# EAGLE design MacroKeypad-Button (EAGLE 9.2.2)
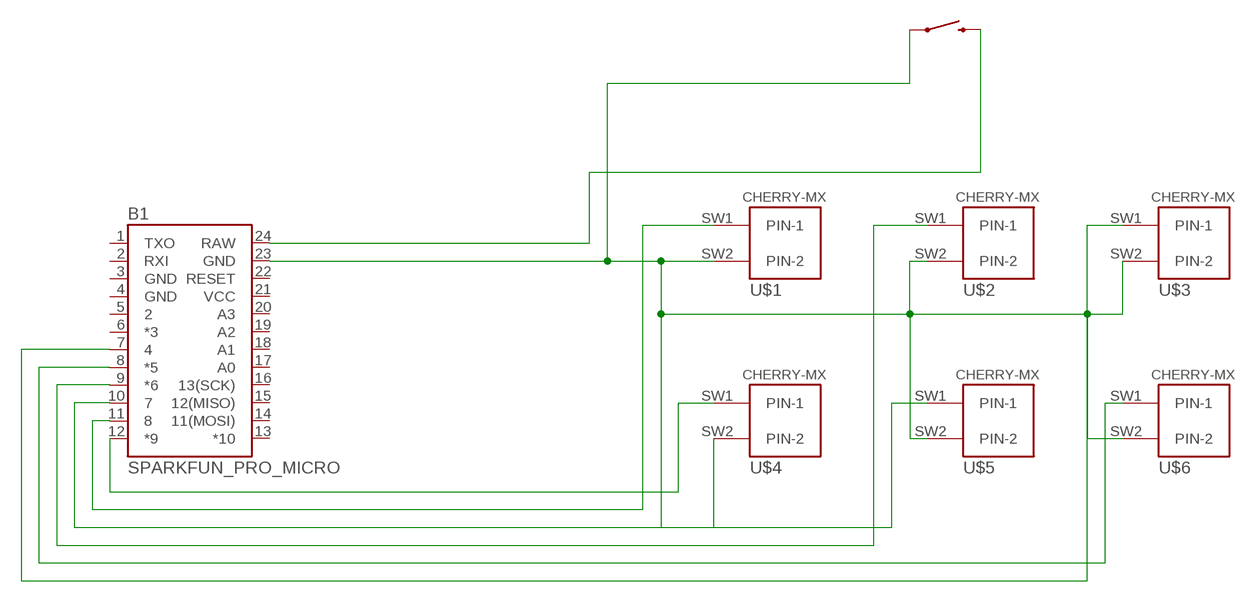
[diagram p0: schematic, sheet 1]

## Parts
B1  SPARKFUN_PRO_MICRO  [SPARKFUN_PRO_MICRO]
S1  MOMENTARY-SWITCH-SPST-PTH-6.0MM  [TACTILE_SWITCH_PTH_6.0MM]
U$1  CHERRY-MX  [CHERRY-MX]
U$2  CHERRY-MX  [CHERRY-MX]
U$3  CHERRY-MX  [CHERRY-MX]
U$4  CHERRY-MX  [CHERRY-MX]
U$5  CHERRY-MX  [CHERRY-MX]
U$6  CHERRY-MX  [CHERRY-MX]

## Nets
GND: B1.23(GND) S1.1 U$1.SW2(PIN-2) U$2.SW2(PIN-2) U$3.SW2(PIN-2) U$4.SW2(PIN-2) U$5.SW2(PIN-2) U$6.SW2(PIN-2)
RESET: B1.24(RAW) S1.3
SW1: B1.11 U$1.SW1(PIN-1)
SW2: B1.9(*6) U$2.SW1(PIN-1)
SW3: B1.7 U$3.SW1(PIN-1)
SW4: B1.12(*9) U$4.SW1(PIN-1)
SW5: B1.10 U$5.SW1(PIN-1)
SW6: B1.8(*5) U$6.SW1(PIN-1)
Unconnected: B1.1(TXO) B1.2(RXI) B1.5 B1.6(*3) B1.13(*10) B1.14(11(MOSI)) B1.15(12(MISO)) B1.16(13(SCK)) B1.17(A0) B1.18(A1) B1.19(A2) B1.20(A3) B1.22(RESET)

## Power pins joined to a net without a drawn wire
GND: B1.3(GND) B1.4(GND)
VCC: B1.21(VCC)

## Library data of the parts
B1 = SparkFun-Boards:SPARKFUN_PRO_MICRO: SparkFun Pro Micro Atmega32U4 compatible footprint. SparkFun Products: 3.3V/8MHz <https://www.sparkfun.com/products/12587> 5V/16MHz <https://www.sparkfun.com/products/12640>
S1 = SparkFun-Switches:MOMENTARY-SWITCH-SPST: Momentary Switch (Pushbutton) - SPST Normally-open (NO) SPST momentary switches (buttons, pushbuttons). Variants PTH-12MM - 12mm square, through-hole Momentary Pushbutton Switch - 12mm Square <https://www.sparkfun.com/products/9190> (COM-09190) PTH-6.0MM, PTH-6.0MM-KIT - 6.0mm square, through-hole Mini Pushbutton Switch <https://www.sparkfun.com/products/97> (COM-00097) KIT package intended for soldering kit's - only one side of pads' copper is exposed. PTH-RIGHT-ANGLE-KIT - Right-angle, through-hole Right Angle Tactile Button <https://www.sparkfun.com/products/10791> - Used on SparkFun BigTime Watch Kit <https://www.sparkfun.com/products/11734> SMD-12MM - 12mm square, surface-mount Tactile Button - SMD (12mm) <https://www.sparkfun.com/products/12993> (COM-12993) Used on SparkFun PicoBoard <https://www.sparkfun.com/products/11888> SMD-4.5MM - 4.5mm Square Trackball Switch Used on SparkFun Blackberry Trackballer Breakout <https://www.sparkfun.com/products/13169> SMD-4.6MMX2.8MM - 4.60mm x 2.80mm, surface mount Used on SparkFun SAMD21 Mini Breakout <https://www.sparkfun.com/products/13664> SMD-5.2MM, SMD-5.2-REDUNDANT - 5.2mm square, surface-mount Mini Pushbutton Switch - SMD <https://www.sparkfun.com/products/8720> (COM-08720) Used on Arduino Pro Mini <https://www.sparkfun.com/products/11114> REDUNDANT package connects both switch circuits together SMD-6.0X3.5MM - 6.0 x 3.5mm, surface mount Momentary Reset Switch SMD <https://www.sparkfun.com/products/8229> (COM-08229) SMD-6.2MM-TALL - 6.2mm square, surface mount Tactile Button - SMD (6mm) <https://www.sparkfun.com/products/12992> Used on SparkFun Digital Sandbox <https://www.sparkfun.com/products/12651> SMD-RIGHT-ANGLE - Right-angle, surface mount Used on SparkFun Block for Intel® Edison - Arduino <https://www.sparkfun.com/products/13036>; PROD_ID: SWCH-08441; SF_SKU: COM-00097
U$1-U$6 = cherrymx:CHERRY-MX: Cherry MX series keyswitch

## Board
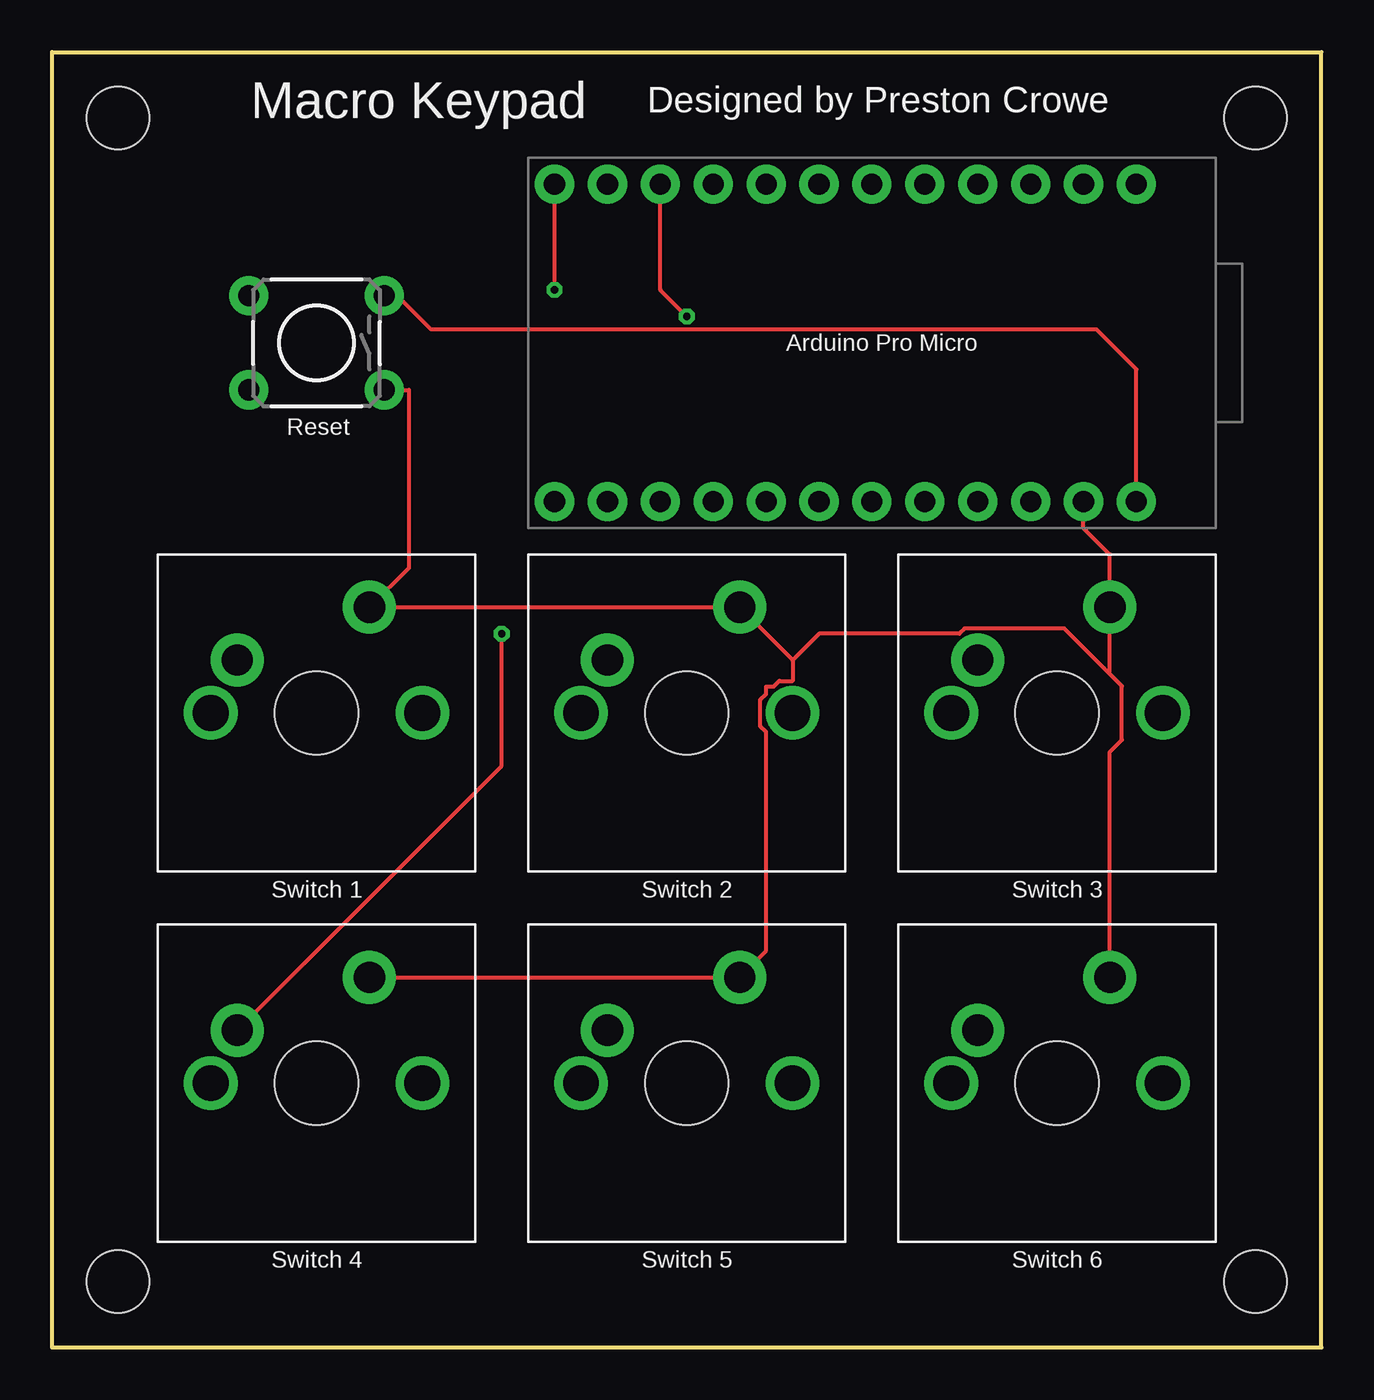
[diagram p1: board, top side]
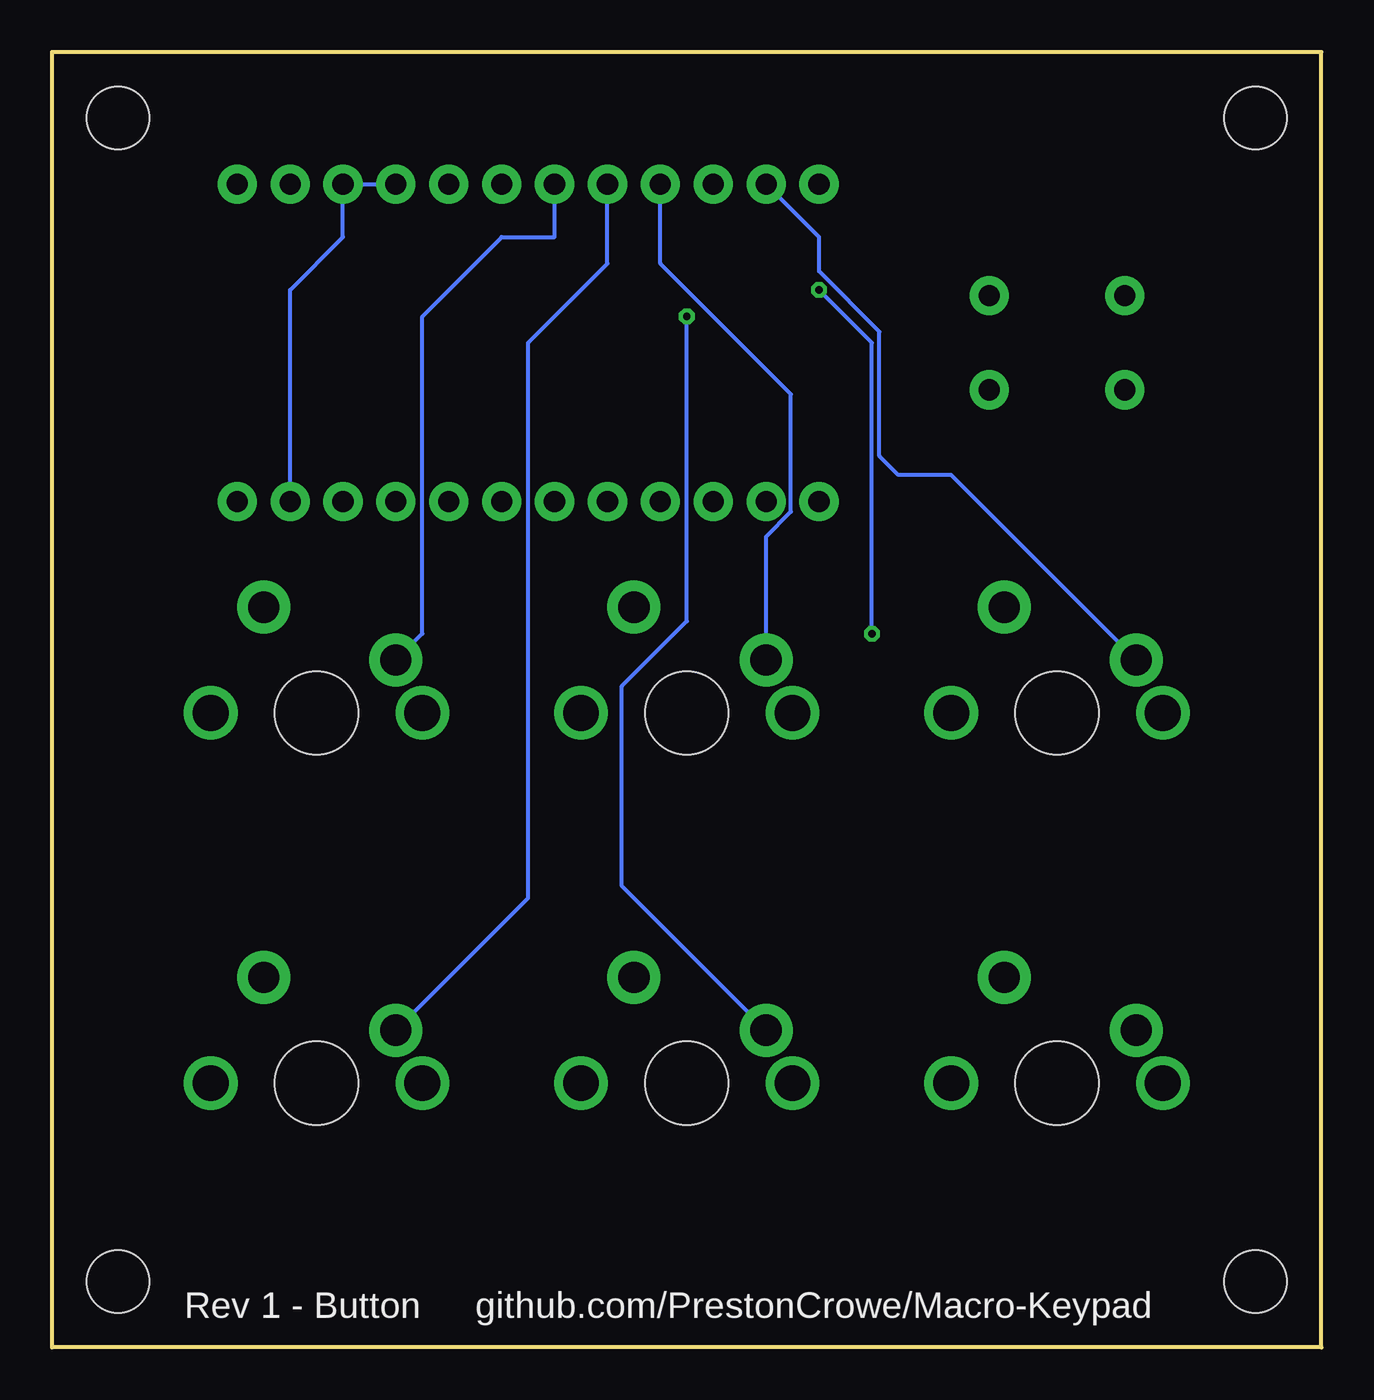
[diagram p2: board, bottom side, seen from below]

Size 60.96 x 62.23 mm. Coordinates in mm from the lower left corner, seen from the top.
Outline: 0,0 60.96,0 60.96,62.23 0,62.23 0,0
Copper layers (1*16): Top 0.035mm / dielectric 1.5mm / Bottom 0.035mm
Design rules "default": minimum track width 6mil, minimum drill 0.35mm, track to track 6mil, track to pad 6mil, pad to pad 6mil, via to via 6mil, smd to smd 6mil, copper to edge 40mil, drill to drill 6mil, minimum pad ring 10mil, minimum via ring 8mil, stop-mask expansion 4mil, vias tented up to drill 0mil, thermal gap 10mil
Holes 3 mm at 57.79,3.17 57.79,59.05 3.18,3.17 3.18,59.05

### Footprints (pad centres in the part's own frame; a part is rotated, then mirrored left to right if it is on the bottom)
SPARKFUN_PRO_MICRO = drill 1.016 pad 1.88: 1 -7.62,12.7; 2 -7.62,10.16; 3 -7.62,7.62; 4 -7.62,5.08; 5 -7.62,2.54; 6 -7.62,0; 7 -7.62,-2.54; 8 -7.62,-5.08; 9 -7.62,-7.62; 10 -7.62,-10.16; 11 -7.62,-12.7; 12 -7.62,-15.24; 13 7.62,-15.24; 14 7.62,-12.7; 15 7.62,-10.16; 16 7.62,-7.62; 17 7.62,-5.08; 18 7.62,-2.54; 19 7.62,0; 20 7.62,2.54; 21 7.62,5.08; 22 7.62,7.62; 23 7.62,10.16; 24 7.62,12.7
TACTILE_SWITCH_PTH_6.0MM = drill 1.016 pad 1.88: 1 -3.251,2.261; 2 3.251,2.261; 3 -3.251,-2.261; 4 3.251,-2.261
CHERRY-MX = drill 1.714 pad 1.93: P$3 -5.08,0; P$4 5.08,0 | drill 1.5 pad 2.54: SW1 -3.81,2.54; SW2 2.54,5.08 | hole 4: 0,0

### Placement (x,y rotation side)
B1  39.37,48.26 270 top
S1  12.7,48.26 180 top
U$1  12.7,30.48 0 top
U$2  30.48,30.48 0 top
U$3  48.26,30.48 0 top
U$4  12.7,12.7 0 top
U$5  30.48,12.7 0 top
U$6  48.26,12.7 0 top

### Tracks (layer width: path | path; a pad name or v marks a point on that pad's centre or on a via)
GND
  Top 0.203: U$6.SW2 50.8,28.61 51.38,29.19 51.38,31.77 50.8,32.35 | 50.8,32.35 U$3.SW2 50.8,38.1 49.53,39.37 B1.23 | U$4.SW2 U$5.SW2 34.29,19.05 34.29,29.57 34.02,29.84 34.02,31.12 34.29,31.39 34.29,31.75 34.65,31.75 34.92,32.02 35.56,32.02 35.56,33.02 | 35.56,33.02 U$2.SW2 U$1.SW2 17.15,37.46 17.15,46 S1.1 | 50.8,32.35 48.6,34.54 43.82,34.54 43.57,34.29 36.83,34.29 35.56,33.02
  Bottom 0.203: B1.4 B1.3 46.99,53.34 49.53,50.8 B1.23
RESET
  Top 0.203: B1.24 52.07,46.99 50.16,48.9 18.21,48.9 16.59,50.52 S1.3
SW1
  Bottom 0.203: U$1.SW1 17.78,41.91 20.32,41.91 21.23,42.82 21.23,48.8 24.13,51.69 24.13,53.34 B1.11
SW2
  Bottom 0.203: U$2.SW1 26.67,38.95 25.48,40.15 25.48,45.8 31.75,52.07 B1.9
SW3
  Bottom 0.203: U$3.SW1 43.18,34.29 43.18,49.53 39.37,53.34 36.83,53.34 B1.7
SW4  (via drill 0.35)
  Top 0.203: U$4.SW1 21.59,27.94 v21.59,34.29 | v24.13,50.8 B1.12
  Bottom 0.203: v21.59,34.29 21.59,48.26 v24.13,50.8
SW5  (via drill 0.35)
  Top 0.203: v30.48,49.53 29.21,50.8 B1.10
  Bottom 0.203: U$5.SW1 33.6,22.17 33.6,31.77 30.48,34.89 v30.48,49.53
SW6
  Bottom 0.203: U$6.SW1 38.1,21.59 38.1,48.26 34.29,52.07 B1.8

### Text on the board
tNames: Designed by Preston Crowe | Macro Keypad | Arduino Pro Micro | Reset | Switch 1 | Switch 2 | Switch 3 | Switch 4 | Switch 5 | Switch 6
bNames: github.com/PrestonCrowe/Macro-Keypad | Rev 1 - Button